# EAGLE design M8-ucam (EAGLE 9.5.2)
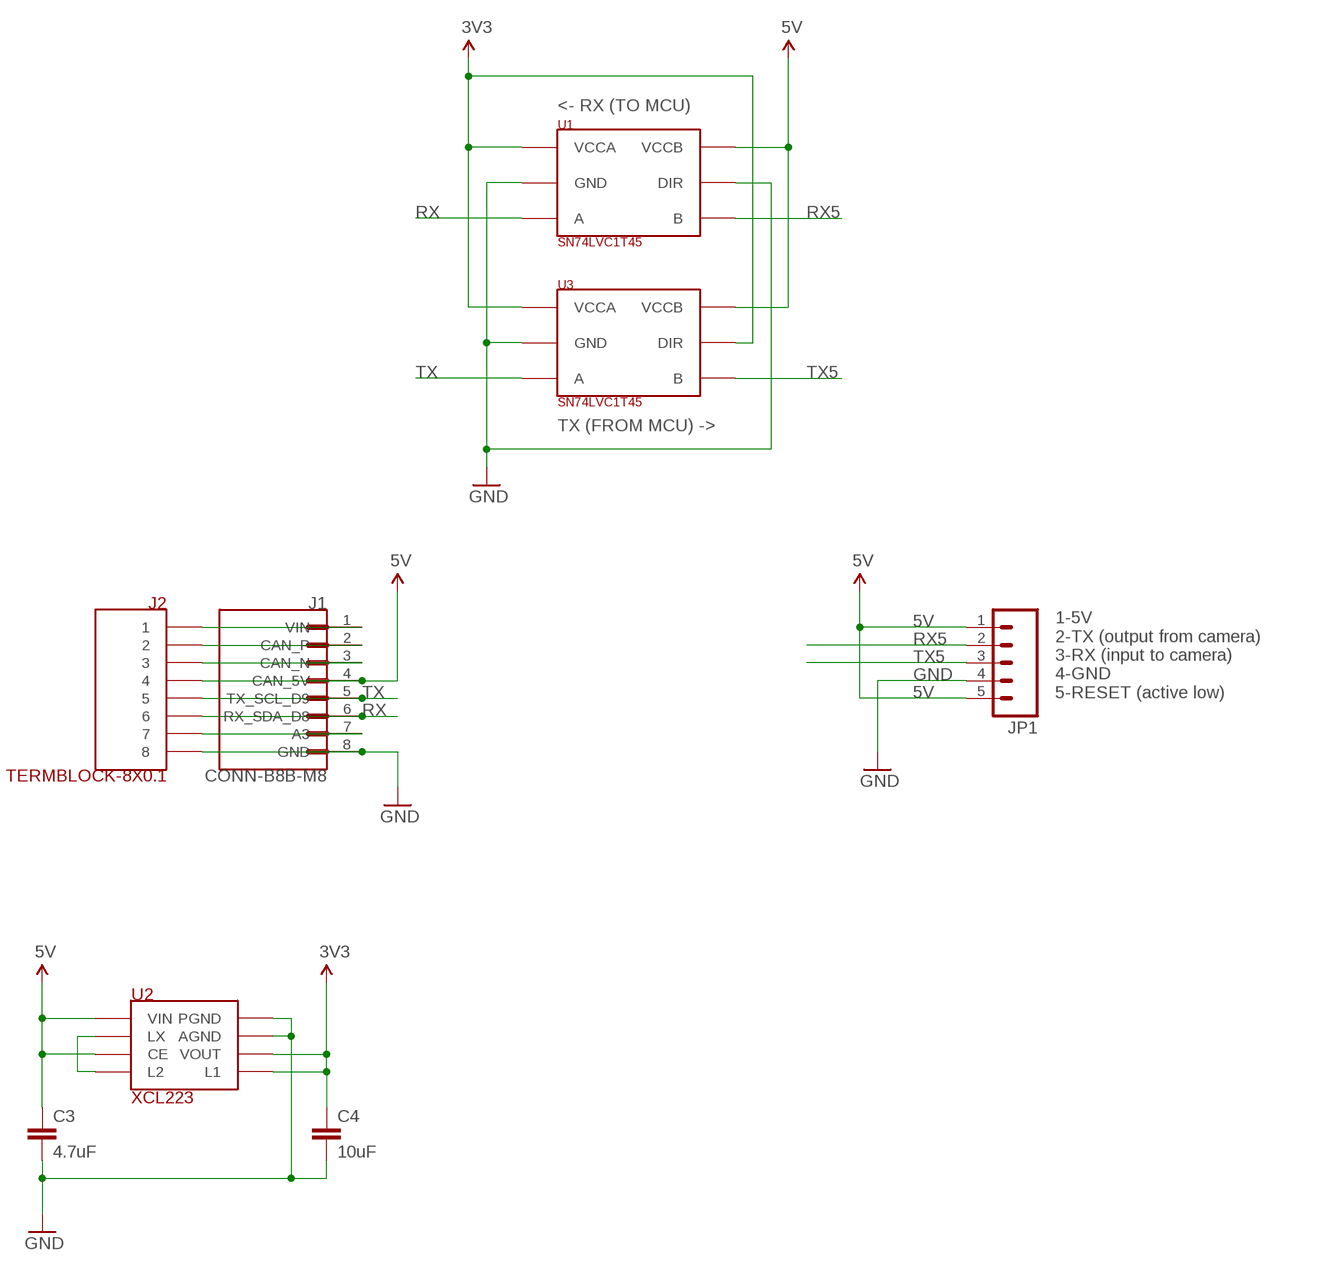
[diagram p0: schematic, sheet 1]

## Parts
C3  4.7uF  CAP-4.7UF-0603  [0603-CAP]
C4  10uF  CAP-10UF-0603  [0603-CAP]
J1  CONN-B8B-M8  [JST_B8B-PH-SM4-TB(LF)(SN)]
J2  TERMBLOCK-8X0.1  [TERMBLOCK-8X0.1]
JP1  M05PTH  [1X05]
U1  SN74LVC1T45  [SC70-TI]
U2  XCL223  REG-XCL223  [REG-XCL223-LESS-CREAM]
U3  SN74LVC1T45  [SC70-TI]

## Nets
3V3: C4.1 U1.1(VCCA) U2.3(VOUT) U2.7(L1) U3.1(VCCA) U3.5(DIR)
5V: C3.1 J1.4(CAN_5V) J2.P$4 JP1.1 JP1.5 U1.6(VCCB) U2.4(CE) U2.6(VIN) U3.6(VCCB)
A3: J1.7(A3) J2.P$7
CAN_N: J1.3(CAN_N) J2.P$3
CAN_P: J1.2(CAN_P) J2.P$2
GND: C3.2 C4.2 J1.8(GND) J2.P$8 JP1.4 U1.2(GND) U1.5(DIR) U2.1(PGND) U2.2(AGND) U3.2(GND)
LX: U2.5(LX) U2.8(L2)
RX: J1.6(RX_SDA_D8) J2.P$6 U1.3(A)
RX5: JP1.2 U1.4(B)
TX: J1.5(TX_SCL_D9) J2.P$5 U3.3(A)
TX5: JP1.3 U3.4(B)
VIN: J1.1(VIN) J2.P$1

## Notes on the sheet
- <- RX (TO MCU)
- TX (FROM MCU) ->
- 1-5V
  2-TX (output from camera)
  3-RX (input to camera)
  4-GND
  5-RESET (active low)

## Library data of the parts
C3 = rickk2:CAP-4.7UF-0603: Murata X5R series CAP CER 4.7UF 6.3V X5R 0603 $0.12 https://www.digikey.com/product-detail/en/murata-electronics-north-america/GRM188R60J475KE19J/490-6407-1-ND/3845604
C4 = rickk2:CAP-10UF-0603: CAP CER 10UF 16V X5R 0805 $ 0.21 https://www.digikey.com/product-detail/en/murata-electronics-north-america/GRM21BR61C106KE15L/490-3886-1-ND/965928
J1 = rickk2:CONN-B8B-M8: PH Series 2 mm Pitch 12 Position SMT Single Row Top Entry Shrouded Header
J2 = rickk2:TERMBLOCK-8X0.1: Term Block 8x0.1" 20-30AWG 6A 125V Max Side Entry On Shore Technology Inc. OSTVN08A150 TERM BLK 8P SIDE ENT 2.54MM PCB 8 Position Wire to Board Terminal Block Horizontal with Board 0.100" (2.54mm) Through Hole https://www.digikey.com/product-detail/en/on-shore-technology-inc/OSTVN08A150/ED10566-ND/1588868
JP1 = rickk2:M05: Header 5 Standard 5-pin 0.1" header. Use with straight break away headers (SKU : PRT-00116), right angle break away headers (PRT-00553), swiss pins (PRT-00743), machine pins (PRT-00117), and female headers (PRT-00115). Molex polarized connector foot print use with SKU : PRT-08230 with associated crimp pins and housings.
U1 U3 = rickk2:SN74LVC1T45: Level translator single SC70-6 Texas Instruments SN74LVC1T45QDCKRQ1 $0.60 IC TRNSLTR BIDIRECTIONAL SC70-6 Voltage Level Translator Bidirectional 1 Circuit 1 Channel 420Mbps SC-70-6 https://www.digikey.com/product-detail/en/texas-instruments/SN74LVC1T45QDCKRQ1/296-39212-1-ND/5143211 Ordered 10 2019-04-12 DIR: LOW=B->A, HIGH=A->B
U2 = rickk2:REG-XCL223: Manufacturer: Torex Semiconductor Ltd Manufacturer Part Number: XCL223A333D2-G DC DC CONVERTER 3.3V Detailed Description: Non-Isolated PoL Modul $2.63 https://www.digikey.com/product-detail/en/torex-semiconductor-ltd/XCL223A333D2-G/893-1416-1-ND/8256118 CIN=4.7uF 10V CL = 10uF 10V VIN MAX=5.5V VOUT=3.3V

## Board
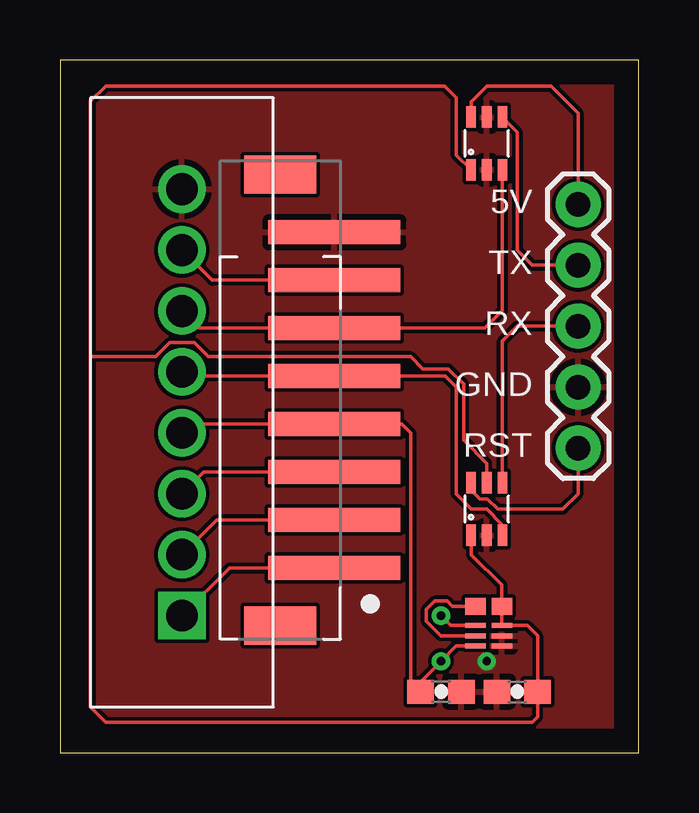
[diagram p1: board, top side]
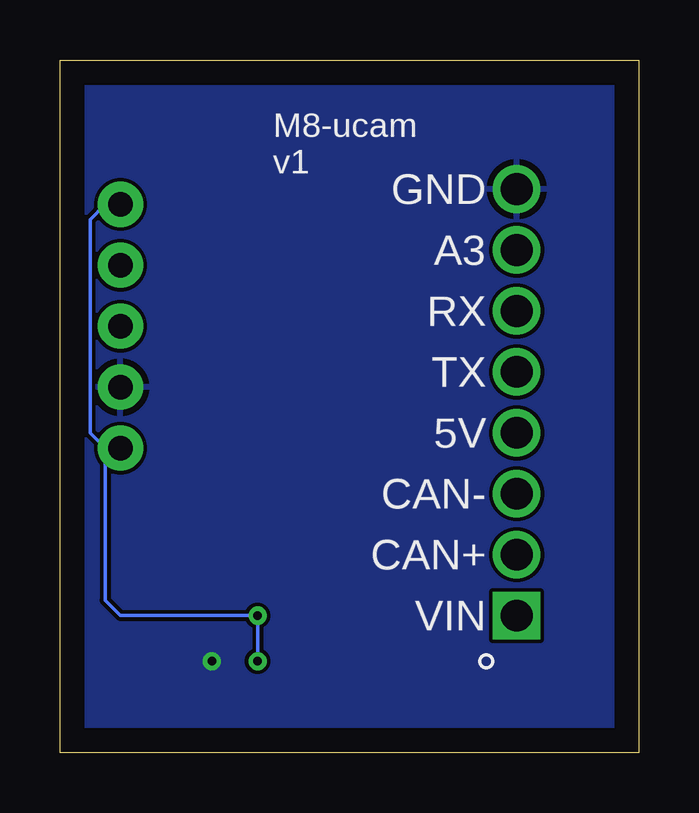
[diagram p2: board, bottom side, seen from below]

Size 24.11 x 28.88 mm. Coordinates in mm from the lower left corner, seen from the top.
Outline: 0,0 24.11,0 24.11,28.88 0,28.88 0,0
Copper layers (1*16): Top 0.035mm / dielectric 1.5mm / Bottom 0.035mm
Design rules "default": minimum track width 6mil, minimum drill 0.35mm, track to track 6mil, track to pad 6mil, pad to pad 6mil, via to via 6mil, smd to smd 6mil, copper to edge 40mil, drill to drill 6mil, minimum pad ring 10mil, minimum via ring 8mil, stop-mask expansion 4mil, vias tented up to drill 0mil, thermal gap 10mil

### Footprints (pad centres in the part's own frame; a part is rotated, then mirrored left to right if it is on the bottom)
0603-CAP = smd 1.1 x 1: 1 -0.85,0; 2 0.85,0
JST_B8B-PH-SM4-TB(LF)(SN) = smd 1 x 5.5: 1 -5,0; 2 -3,0; 3 -1,0; 4 1,0; 5 3,0; 6 5,0; 7 7,0; 8 9,0 | smd 1.6 x 3: P1 -7.4,2.25; P2 11.4,2.25
TERMBLOCK-8X0.1 = drill 1.321 square: P$1 -8.89,0 | drill 1.321: P$2 -6.35,0; P$3 -3.81,0; P$4 -1.27,0; P$5 1.27,0; P$6 3.81,0; P$7 6.35,0; P$8 8.89,0
1X05 = drill 1.016 pad 1.88: 1 0,0; 2 2.54,0; 3 5.08,0; 4 7.62,0; 5 10.16,0
SC70-TI = smd 0.4 x 0.9: 1 -0.65,-1.1; 2 0,-1.1; 3 0.65,-1.1; 4 0.65,1.1; 5 0,1.1; 6 -0.65,1.1
REG-XCL223-LESS-CREAM = smd 0.85 x 0.21: 1 0,0; 2 0,0.43; 3 0,0.86; 4 -1.11,0.86; 5 -1.11,0.43; 6 -1.11,0 | smd 0.85 x 0.7: 7 0,1.655; 8 -1.11,1.655

### Placement (x,y rotation side)
C3  15.88,2.54 0 top
C4  19.05,2.54 180 top
J1  11.43,12.7 90 top
J2  5.08,14.61 90 top
JP1  21.59,22.86 270 top
U1  17.78,25.4 0 top
U2  18.41,4.45 0 top
U3  17.78,10.16 0 top

### Tracks (layer width: path | path; a pad name or v marks a point on that pad's centre or on a via)
3V3
  Top 0.152: U3.1 17.14,9.04 17.14,8.26 18.41,6.99 U2.7 U2.3 19.46,5.3 19.9,4.87 C4.1 19.9,1.49 19.68,1.27 1.91,1.27 1.27,1.91 1.27,16.51 | U1.1 16.51,24.92 16.51,27.3 16.03,27.79 1.91,27.79 1.27,27.15 1.27,16.51 | 1.27,16.51 3.99,16.51 4.58,17.09 5.58,17.09 6.17,16.51 14.61,16.51 15.11,16 16.18,16 16.82,15.37 16.82,13.03 17.78,12.06 U3.5
5V  (via drill 0.35)
  Top 0.152: J2.P$4 5.45,13.7 J1.4 14.24,13.7 14.61,13.34 14.61,2.96 C3.1 15.03,2.96 v15.88,3.81 16.51,4.45 U2.6 | U2.4 16.29,5.3 v15.88,5.71 | U1.6 17.13,27.14 17.78,27.79 20.47,27.79 21.59,26.67 JP1.1 | JP1.5 21.59,10.79 20.95,10.16 18.23,10.16 17.81,10.58 17.48,10.58 17.13,10.94 U3.6
  Bottom 0.152: v15.88,3.81 v15.88,5.71 21.59,5.71 22.23,6.35 22.23,12.06 JP1.5 22.23,12.7 22.86,13.34 22.86,22.23 22.23,22.86 JP1.1
A3
  Top 0.152: J1.7 6.33,19.7 J2.P$7
CAN_N
  Top 0.152: J1.3 5.99,11.7 J2.P$3
CAN_P
  Top 0.152: J1.2 6.53,9.7 J2.P$2
GND  (via drill 0.35)
  other vias: 17.78,3.81
  pour Top: 0,0 0,29.21 25.4,29.21 25.4,0
  pour Bottom: 0,0 0,30.48 26.67,30.48 26.67,0
LX
  Top 0.152: U2.8 16.35,6.1 16.13,6.32 15.62,6.32 15.27,5.97 15.27,5.46 15.86,4.88 U2.5
RX
  Top 0.152: J2.P$6 5.79,17.7 J1.6 17.7,17.7 18.43,18.43 U1.3
RX5
  Top 0.152: U1.4 19.05,25.88 19.05,20.95 19.68,20.32 JP1.2
TX
  Top 0.152: J2.P$5 5.25,15.7 J1.5 16.05,15.7 16.51,15.24 16.51,10.79 17.14,10.16 17.78,10.16 18.41,9.53 18.41,9.07 U3.3
TX5
  Top 0.152: U3.4 18.43,17.16 19.05,17.78 JP1.3
VIN
  Top 0.152: J2.P$1 7.07,7.7 J1.1

### Text on the board
tPlace: 5V | TX | RX | GND | RST
bPlace: GND | M8-ucam / v1 | A3 | RX | TX | 5V | CAN- | CAN+ | VIN